# EAGLE design battery_monitor (EAGLE 9.4.1)
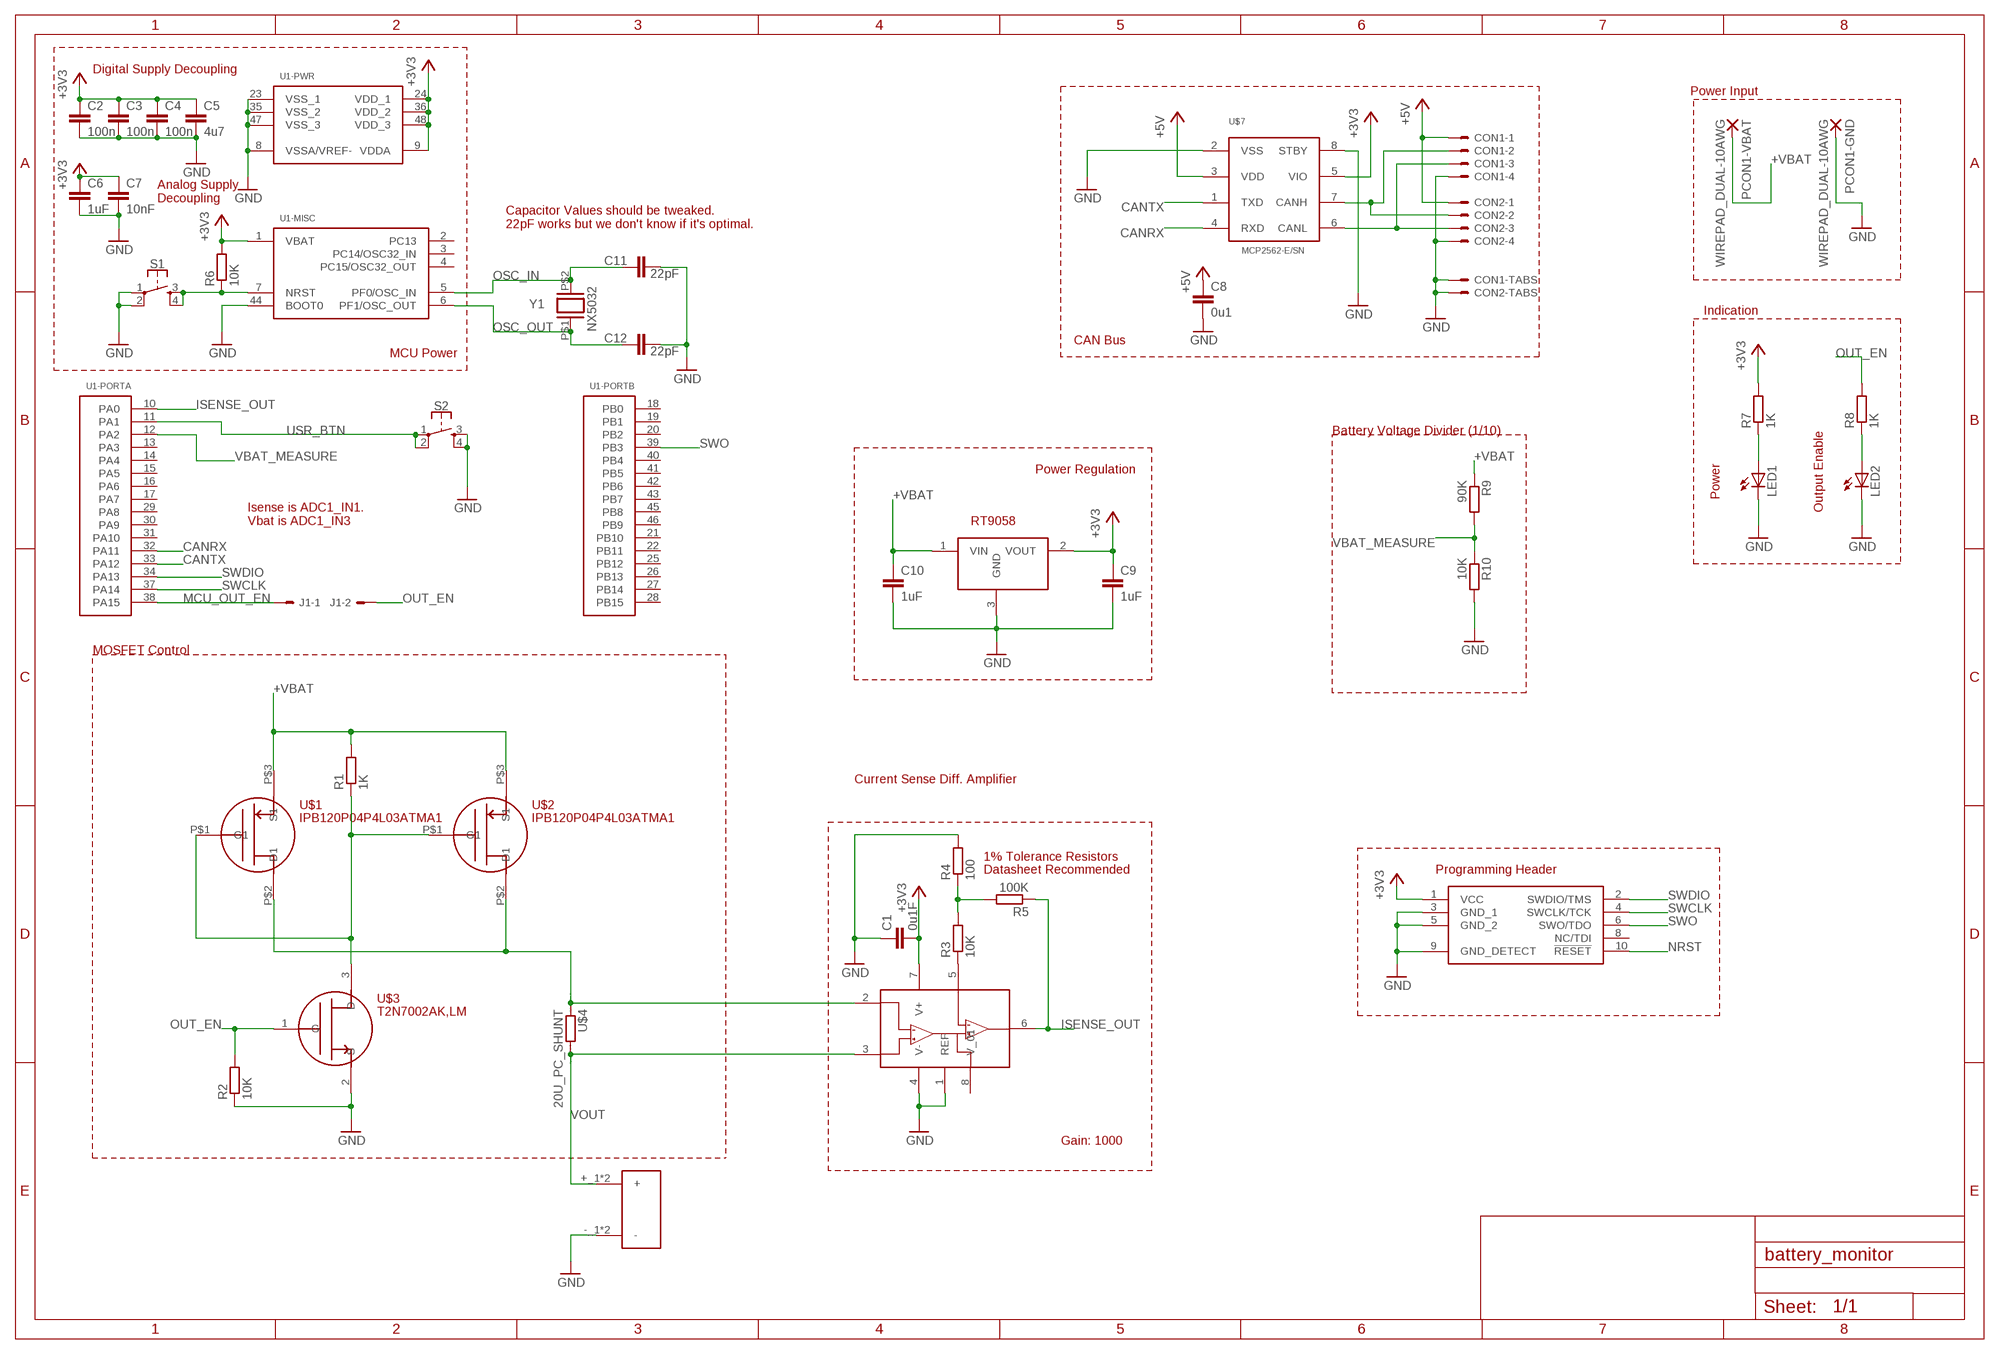
[diagram p0: schematic, sheet 1]

## Parts
C1  0u1F  C-EUC0805  [C0805]
C2  100n  C-EUC0805  [C0805]
C3  100n  C-EUC0805  [C0805]
C4  100n  C-EUC0805  [C0805]
C5  4u7  C-EUC0805  [C0805]
C6  1uF  C-EUC0805  [C0805]
C7  10nF  C-EUC0805  [C0805]
C8  0u1  C-EUC0805  [C0805]
C9  1uF  C-EUC0805  [C0805]
C10  1uF  C-EUC0805  [C0805]
C11  22pF  C-EUC0805  [C0805]
C12  22pF  C-EUC0805  [C0805]
CON1  SM04B-GHS-TB  [SM04B-GHS-TB]
CON2  SM04B-GHS-TB  [SM04B-GHS-TB]
J1  2PIN_HDR  [2PIN-HDR]
JP1  CORTEX-M-DBG  [FTSH-105-01-F-DV-007]
LED1  LEDCHIPLED_0805  [CHIPLED_0805]
LED2  LEDCHIPLED_0805  [CHIPLED_0805]
PCON1  WIREPAD_DUAL-10AWG  [WIREPAD_DUAL-10AWG]
R1  1K  R-EU_R0805  [R0805]
R2  10K  R-EU_R0805  [R0805]
R3  10K  R-EU_R0805  [R0805]
R4  100  R-EU_R0805  [R0805]
R5  100K  R-EU_R0805  [R0805]
R6  10K  R-EU_R0805  [R0805]
R7  1K  R-EU_R0805  [R0805]
R8  1K  R-EU_R0805  [R0805]
R9  90K  R-EU_R0805  [R0805]
R10  10K  R-EU_R0805  [R0805]
S1  MOMENTARY-SWITCH-SPST-2-SMD-4.6X2.8MM  [TACTILE_SWITCH_SMD_4.6X2.8MM]
S2  MOMENTARY-SWITCH-SPST-2-SMD-4.6X2.8MM  [TACTILE_SWITCH_SMD_4.6X2.8MM]
U1  STM32F303CB  [LQFP48]
U$1  IPB120P04P4L03ATMA1  [INFINEON_PG-TO263-3-2]
U$2  IPB120P04P4L03ATMA1  [INFINEON_PG-TO263-3-2]
U$3  T2N7002AK,LM  [SOT23]
U$4  20U_PC_SHUNT  [RSENSE_20U]
U$5  PP45_HOR_4GRD  [PP45_HOR_4GRD]
U$6  INA145  [SOIC8]
U$7  MCP2562-E/SN  [SOIC8]
U$8  RICHTEK_RT9058  [SOT23]
Y1  NX5032  [NX5032]

## Nets
+3V3: C1.2 C2.1 C3.1 C4.1 C5.1 C6.1 C7.1 C9.1 JP1.1(VCC) R6.2 R7.2 U1.1(-MISC:VBAT) U1.9(-PWR:VDDA) U1.24(-PWR:VDD_1) U1.36(-PWR:VDD_2) U1.48(-PWR:VDD_3) U$6.7(V+) U$7.5(VIO) U$8.2(VOUT)
+5V: C8.1 CON1.P$1 CON2.P$1 U$7.3(VDD)
+VBAT: C10.1 PCON1.+ R1.2 R9.1 U$1.P$3(S1) U$2.P$3(S1) U$8.1(VIN)
CANH: CON1.P$2 CON2.P$2 U$7.7(CANH)
CANL: CON1.P$3 CON2.P$3 U$7.6(CANL)
CANRX: U1.32(-PORTA:PA11) U$7.4(RXD)
CANTX: U1.33(-PORTA:PA12) U$7.1(TXD)
GND: C1.1 C2.2 C3.2 C4.2 C5.2 C6.2 C7.2 C8.2 C9.2 C10.2 C11.2 C12.2 CON1.P$4 CON1.P$5 CON1.P$6 CON2.P$4 CON2.P$5 CON2.P$6 JP1.3(GND_1) JP1.5(GND_2) JP1.9(GND_DETECT) LED1.C LED2.C PCON1.- R2.1 R4.2 R10.2 S1.1 S1.2 S2.3 S2.4 U1.8(-PWR:VSSA/VREF-) U1.23(-PWR:VSS_1) U1.35(-PWR:VSS_2) U1.44(-MISC:BOOT0) U1.47(-PWR:VSS_3) U$3.2(S) U$5.-_1(-) U$5.-_2(-) U$6.1(REF) U$6.4(V-) U$7.2(VSS) U$7.8(STBY) U$8.3(GND)
ISENSE_A: U$1.P$2(D1) U$2.P$2(D1) U$4.P$1 U$4.P$3 U$6.2(IN-)
ISENSE_OUT: R5.1 U1.10(-PORTA:PA0) U$6.6(OUT)
MCU_OUT_EN: J1.P$1 U1.38(-PORTA:PA15)
N$1: R1.1 U$1.P$1(G1) U$2.P$1(G1) U$3.3(D)
N$3: R3.1 U$6.5(VG)
N$4: R3.2 R4.1 R5.2
N$7: LED1.A R7.1
N$9: LED2.A R8.1
NRST: JP1.10(!RESET) R6.1 S1.3 S1.4 U1.7(-MISC:NRST)
OSC_IN: C11.1 U1.5(-MISC:PF0/OSC_IN) Y1.P$2
OSC_OUT: C12.1 U1.6(-MISC:PF1/OSC_OUT) Y1.P$1
OUT_EN: J1.P$2 R2.2 R8.2 U$3.1(G)
SWCLK: JP1.4(SWCLK/TCK) U1.37(-PORTA:PA14)
SWDIO: JP1.2(SWDIO/TMS) U1.34(-PORTA:PA13)
SWO: JP1.6(SWO/TDO) U1.39(-PORTB:PB3)
USR_BTN: S2.1 S2.2 U1.11(-PORTA:PA1)
VBAT_MEASURE: R9.2 R10.1 U1.12(-PORTA:PA2)
VOUT: U$4.P$2 U$4.P$4 U$5.+_1(+) U$5.+_2(+) U$6.3(IN+)
Unconnected: JP1.8(NC/TDI) U1.2(-MISC:PC13) U1.3(-MISC:PC14/OSC32_IN) U1.4(-MISC:PC15/OSC32_OUT) U1.13(-PORTA:PA3) U1.14(-PORTA:PA4) U1.15(-PORTA:PA5) U1.16(-PORTA:PA6) U1.17(-PORTA:PA7) U1.18(-PORTB:PB0) U1.19(-PORTB:PB1) U1.20(-PORTB:PB2) U1.21(-PORTB:PB10) U1.22(-PORTB:PB11) U1.25(-PORTB:PB12) U1.26(-PORTB:PB13) U1.27(-PORTB:PB14) U1.28(-PORTB:PB15) U1.29(-PORTA:PA8) U1.30(-PORTA:PA9) U1.31(-PORTA:PA10) U1.40(-PORTB:PB4) U1.41(-PORTB:PB5) U1.42(-PORTB:PB6) U1.43(-PORTB:PB7) U1.45(-PORTB:PB8) U1.46(-PORTB:PB9) U$6.8(V_01)

## Notes on the sheet
- Digital Supply Decoupling
- Power Input
- Analog Supply
  Decoupling
- Capacitor Values should be tweaked.
  22pF works but we don't know if it's optimal.
- Indication
- CAN Bus
- MCU Power
- Battery Voltage Divider (1/10)
- Power Regulation
- Power
- Output Enable
- Isense is ADC1_IN1.
  Vbat is ADC1_IN3
- RT9058
- MOSFET Control
- Current Sense Diff. Amplifier
- 1% Tolerance Resistors
- Datasheet Recommended | Programming Header
- Gain: 1000

## Library data of the parts
C1-C8 C11 C12 = resistor:C-EU: CAPACITOR, European symbol
C9 C10 = rcl:C-EU: CAPACITOR, European symbol; SPICEPREFIX: C
CON1 CON2 = SPEAR-general:SM04B-GHS-TB
J1 = SPEAR-battery-monitor:2PIN_HDR
JP1 = SPEAR-general:CORTEX-M-DBG: Cortex-M Debug Header Standard debug/programming header used for programming Cortex parts. Does not include shroud but does have key pin removed.
LED1 LED2 = led:LED: LED OSRAM: - CHIPLED LG R971, LG N971, LY N971, LG Q971, LY Q971, LO R971, LY R971 LH N974, LH R974 LS Q976, LO Q976, LY Q976 LO Q996 - Hyper CHIPLED LW Q18S LB Q993, LB Q99A, LB R99A - SideLED LS A670, LO A670, LY A670, LG A670, LP A670 LB A673, LV A673, LT A673, LW A673 LH A674 LY A675 LS A676, LA A676, LO A676, LY A676, LW A676 LS A679, LY A679, LG A679 - Hyper Micro SIDELED® LS Y876, LA Y876, LO Y876, LY Y876 LT Y87S - SmartLED LW L88C, LW L88S LB L89C, LB L89S, LG L890 LS L89K, LO L89K, LY L89K LS L896, LA L896, LO L896, LY L896 - TOPLED LS T670, LO T670, LY T670, LG T670, LP T670 LSG T670, LSP T670, LSY T670, LOP T670, LYG T670 LG T671, LOG T671, LSG T671 LB T673, LV T673, LT T673, LW T673 LH T674 LS T676, LA T676, LO T676, LY T676, LB T676, LH T676, LSB T676, LW T676 LB T67C, LV T67C, LT T67C, LS T67K, LO T67K, LY T67K, LW E67C LS E67B, LA E67B, LO E67B, LY E67B, LB E67C, LV E67C, LT E67C LW T67C LS T679, LY T679, LG T679 LS T770, LO T770, LY T770, LG T770, LP T770 LB T773, LV T773, LT T773, LW T773 LH T774 LS E675, LA E675, LY E675, LS T675 LS T776, LA T776, LO T776, LY T776, LB T776 LHGB T686 LT T68C, LB T68C - Hyper Mini TOPLED® LB M676 - Mini TOPLED Santana® LG M470 LS M47K, LO M47K, LY M47K Source: http://www.osram.convergy.de LUXEON: - LUMILED® LXK2-PW12-R00, LXK2-PW12-S00, LXK2-PW14-U00, LXK2-PW14-V00 LXK2-PM12-R00, LXK2-PM12-S00, LXK2-PM14-U00 LXK2-PE12-Q00, LXK2-PE12-R00, LXK2-PE12-S00, LXK2-PE14-T00, LXK2-PE14-U00 LXK2-PB12-K00, LXK2-PB12-L00, LXK2-PB12-M00, LXK2-PB14-N00, LXK2-PB14-P00, LXK2-PB14-Q00 LXK2-PR12-L00, LXK2-PR12-M00, LXK2-PR14-Q00, LXK2-PR14-R00 LXK2-PD12-Q00, LXK2-PD12-R00, LXK2-PD12-S00 LXK2-PH12-R00, LXK2-PH12-S00 LXK2-PL12-P00, LXK2-PL12-Q00, LXK2-PL12-R00 Source: www.luxeon.com KINGBRIGHT: KA-3528ASYC Source: www.kingbright.com
PCON1 = SPEAR-battery-monitor:WIREPAD_DUAL-10AWG
R1-R10 = resistor:R-EU_: RESISTOR, European symbol
S1 S2 = SPEAR-arm-control:MOMENTARY-SWITCH-SPST-2: Momentary Switch (Pushbutton) - SPST - Two Circuits Normally-open (NO) SPST momentary switches (buttons, pushbuttons). Schematic symbol includes two switch circuits. Variants SMD-4.6MMX2.8MM - 4.60mm x 2.80mm Tactile Momentary Button Switch - Used on SparkFun SAMD21 Mini Breakout <https://www.sparkfun.com/products/13664> SMD-5.2MM - Mini Pushbutton Switch - SMD <https://www.sparkfun.com/products/8720> - Used on Arduino Pro Mini <https://www.sparkfun.com/products/11114>; PROD_ID: SWCH-13065
U1 = SPEAR-general:STM32F303CB: STM32F303CBT 32-bit microcontroller in an LQFP48 package - 128Kbytes flash.
U$1 U$2 = SPEAR-battery-monitor:IPB120P04P4L03ATMA1: Infineon IPB120P04P4L03ATMA1 High power, low Rds(on) P-channel MOSFET. Datasheet here. <https://www.infineon.com/dgdl/Infineon-IPP_B_I120P04P4L_03-DS-v01_01-EN.pdf?fileId=db3a30432f69f146012f783b3b5a2e3f&ack=t>
U$3 = SPEAR-battery-monitor:T2N7002AK,LM: T2N7002AK Small N-channel MOSFET from Toshiba. Datasheet here. <file:///C:/Users/David/Downloads/T2N7002AK_datasheet_en_20150401.pdf>
U$4 = SPEAR-battery-monitor:20U_PC_SHUNT: PCB Current Shunt Approximately 20uOhm. If you want actual measurements, verify first.
U$5 = SPEAR-general:PP45_HOR_4GRD
U$6 = SPEAR-battery-monitor:INA145: INA145 Texas Instruments differential amplifier. Programmable gain from 1-1000. Datasheet. <http://www.ti.com/lit/ds/symlink/ina145.pdf>
U$7 = SPEAR-general:MCP2562-E/SN
U$8 = SPEAR-battery-monitor:RICHTEK_RT9058: RT9058 3v3 LDO regulator. Datasheet. <https://www.richtek.com/assets/product_file/RT9058/DS9058-01.pdf>
Y1 = SPEAR-general:NX5032

## Board
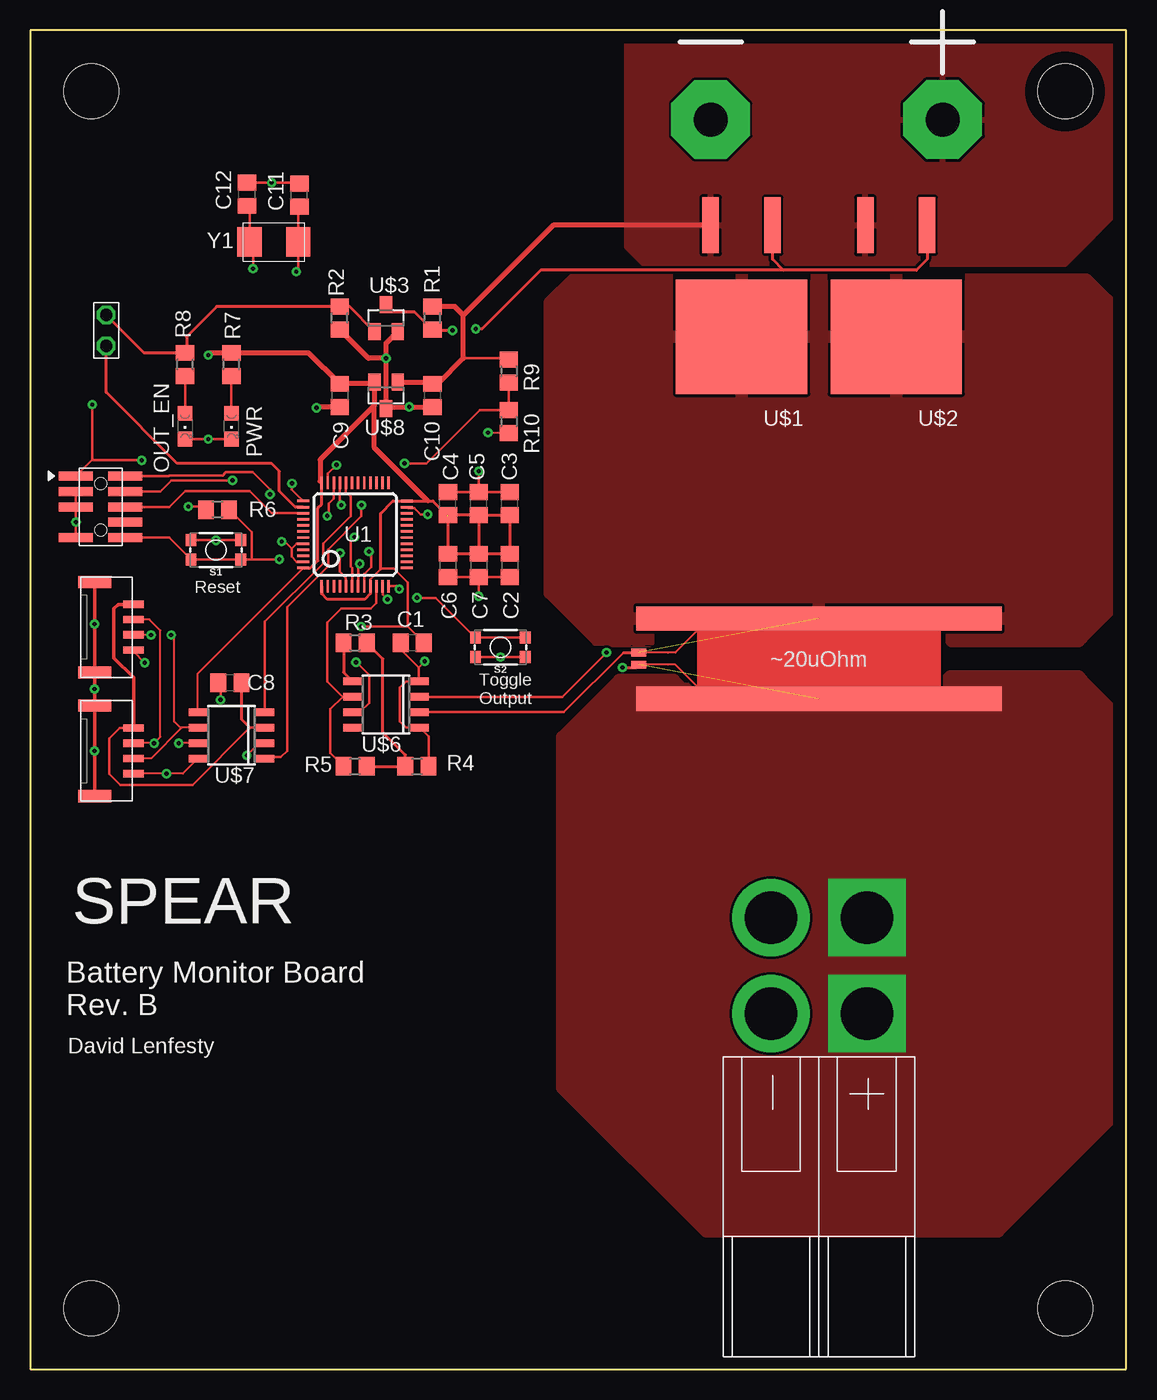
[diagram p1: board, top side]
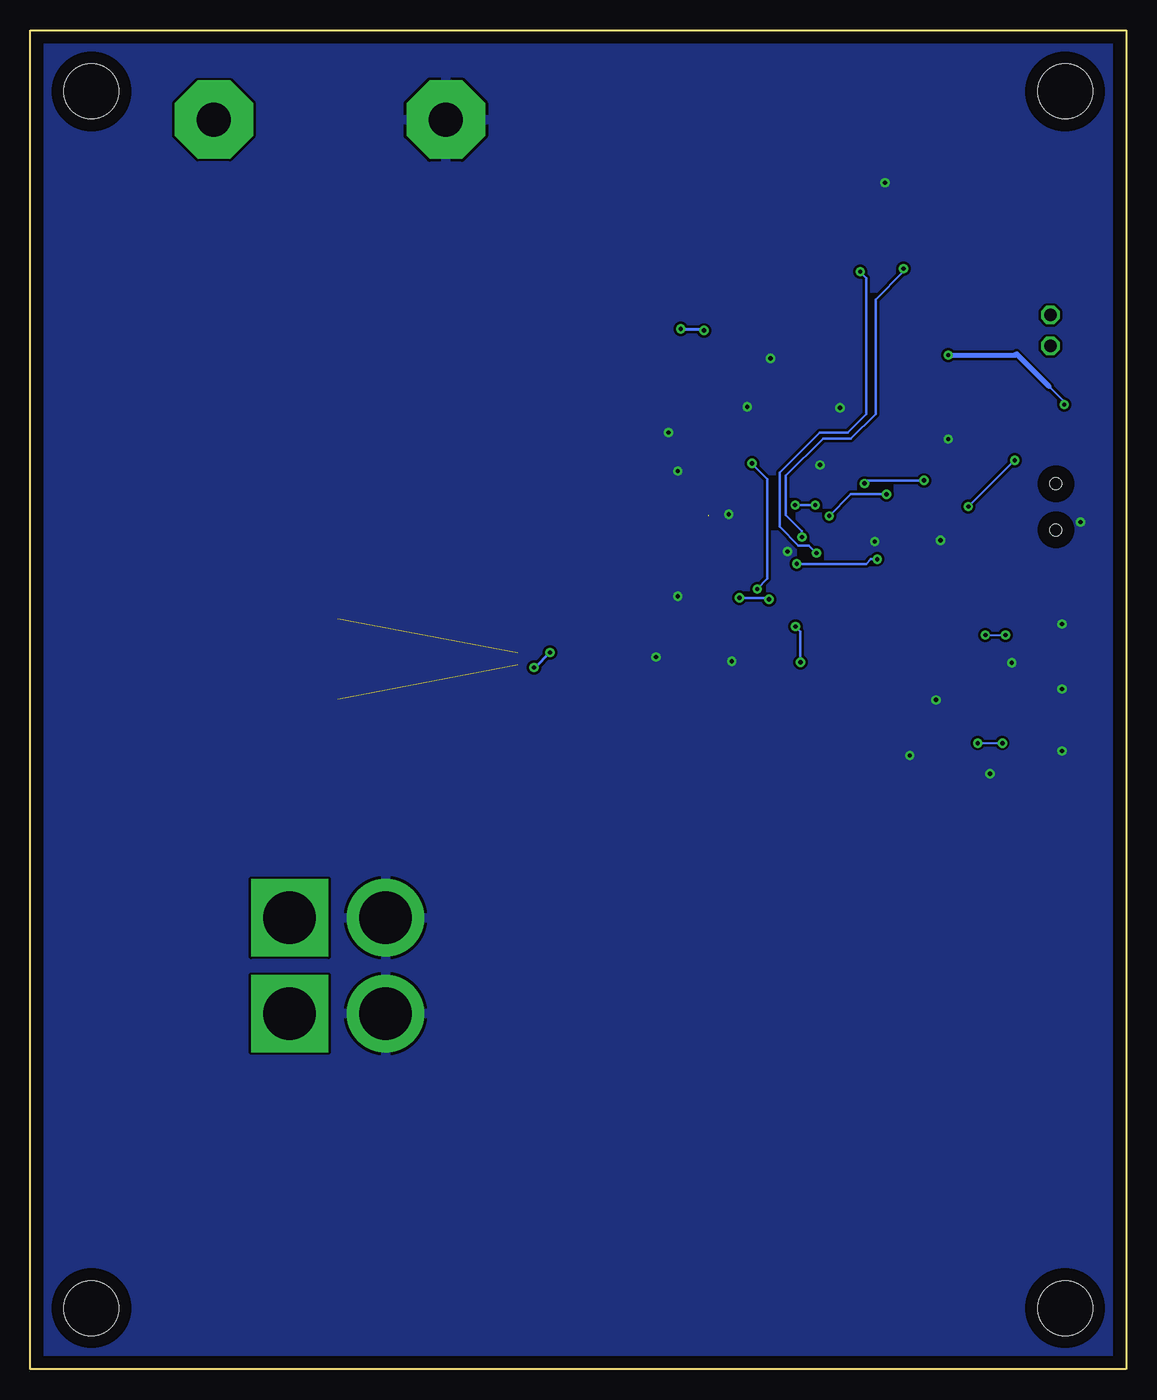
[diagram p2: board, bottom side, seen from below]

Size 90 x 110 mm. Coordinates in mm from the lower left corner, seen from the top.
Outline: 0,0 90,0 90,110 0,110 0,0
Copper layers (1*16): Top 0.035mm / dielectric 1.5mm / Bottom 0.035mm
Design rules "default *": minimum track width 6mil, minimum drill 0.35mm, track to track 8mil, track to pad 8mil, pad to pad 8mil, via to via 8mil, smd to smd 8mil, copper to edge 40mil, drill to drill 6mil, minimum pad ring 10mil, minimum via ring 8mil, stop-mask expansion 4mil, vias tented up to drill 0mil, thermal gap 10mil
Holes 4.5 mm at 5,5 85,5 85,105 5,105

### Footprints (pad centres in the part's own frame; a part is rotated, then mirrored left to right if it is on the bottom)
C0805 = smd 1.3 x 1.5: 1 -0.95,0; 2 0.95,0
SM04B-GHS-TB = smd 0.6 x 1.7: P$1 -1.875,0.85; P$2 -0.625,0.85; P$3 0.625,0.85; P$4 1.875,0.85 | smd 1 x 2.7: P$5 -3.725,-2.35; P$6 3.725,-2.35
2PIN-HDR = drill 1.016 octagon: P$1 -1.27,0; P$2 1.27,0
FTSH-105-01-F-DV-007 = smd 0.737 x 2.794: 1 -2.54,-2.032; 2 -2.54,2.032; 3 -1.27,-2.032; 4 -1.27,2.032; 5 0,-2.032; 6 0,2.032; 8 1.27,2.032; 9 2.54,-2.032; 10 2.54,2.032 | hole 0.965: -1.905,0; 1.905,0
CHIPLED_0805 = smd 1.2 x 1.2: A 0,-1.05; C 0,1.05
WIREPAD_DUAL-10AWG = drill 2.794 pad 6.452 octagon: + -8.89,0; - 10.16,0
R0805 = smd 1.3 x 1.5: 1 -0.95,0; 2 0.95,0
TACTILE_SWITCH_SMD_4.6X2.8MM = smd 0.9 x 1: 1 -2.05,-0.8; 2 2.05,-0.8; 3 2.05,0.8; 4 -2.05,0.8
LQFP48 = smd 0.2 x 1: 1 -2.75,-4.25; 2 -2.25,-4.25; 3 -1.75,-4.25; 4 -1.25,-4.25; 5 -0.75,-4.25; 6 -0.25,-4.25; 7 0.25,-4.25; 8 0.75,-4.25; 9 1.25,-4.25; 10 1.75,-4.25; 11 2.25,-4.25; 12 2.75,-4.25; 25 2.75,4.25; 26 2.25,4.25; 27 1.75,4.25; 28 1.25,4.25; 29 0.75,4.25; 30 0.25,4.25; 31 -0.25,4.25; 32 -0.75,4.25; 33 -1.25,4.25; 34 -1.75,4.25; 35 -2.25,4.25; 36 -2.75,4.25 | smd 1 x 0.2: 13 4.25,-2.75; 14 4.25,-2.25; 15 4.25,-1.75; 16 4.25,-1.25; 17 4.25,-0.75; 18 4.25,-0.25; 19 4.25,0.25; 20 4.25,0.75; 21 4.25,1.25; 22 4.25,1.75; 23 4.25,2.25; 24 4.25,2.75; 37 -4.25,2.75; 38 -4.25,2.25; 39 -4.25,1.75; 40 -4.25,1.25; 41 -4.25,0.75; 42 -4.25,0.25; 43 -4.25,-0.25; 44 -4.25,-0.75; 45 -4.25,-1.25; 46 -4.25,-1.75; 47 -4.25,-2.25; 48 -4.25,-2.75
INFINEON_PG-TO263-3-2 = smd 1.35 x 4.6: P$1 -2.54,0; P$3 2.54,0 | smd 10.8 x 9.4: P$2 0,9.15
SOT23 = smd 1 x 1.4: 1 -0.95,-1.1; 2 0.95,-1.1; 3 0,1.1
RSENSE_20U = smd 30 x 2: P$1 0,3.26; P$2 0,-3.34 | smd 1.27 x 0.635: P$3 -14.8,0.46; P$4 -14.8,-0.54
PP45_HOR_4GRD = drill 4.318 pad 6.35 square: +_1 0,3.937; +_2 -7.874,3.937 | drill 4.318 pad 6.35: -_1 0,-3.937; -_2 -7.874,-3.937
SOIC8 = smd 0.6 x 1.5: 1 -1.905,-2.75; 2 -0.635,-2.75; 3 0.635,-2.75; 4 1.905,-2.75; 5 1.905,2.75; 6 0.635,2.75; 7 -0.635,2.75; 8 -1.905,2.75
NX5032 = smd 2 x 2.4: P$1 -2,0; P$2 2,0

### Placement (x,y rotation side)
C1  31.37,59.69 0 top
C2  39.37,66.04 270 top
C3  39.37,71.12 90 top
C4  34.29,71.12 90 top
C5  36.83,71.12 90 top
C6  34.29,66.04 270 top
C7  36.83,66.04 270 top
C8  16.38,56.39 180 top
C9  25.4,80.01 270 top
C10  33.02,80.01 270 top
C11  22.09,96.45 90 top
C12  17.79,96.53 90 top
CON1  7.62,50.8 270 top
CON2  7.62,60.96 270 top
J1  6.22,85.34 90 top
JP1  5.77,70.85 270 top
LED1  16.51,77.47 180 top
LED2  12.7,77.47 180 top
PCON1  66.04,102.68 180 top
R1  33.02,86.36 90 top
R2  25.4,86.36 90 top
R3  26.67,59.69 0 top
R4  31.75,49.53 0 top
R5  26.67,49.53 0 top
R6  15.37,70.61 180 top
R7  16.51,82.55 90 top
R8  12.7,82.55 90 top
R9  39.29,82 270 top
R10  39.29,77.86 270 top
S1  15.24,67.31 180 top
S2  38.61,59.31 180 top
U1  26.67,68.58 0 top
U$1  58.42,93.98 180 top
U$2  71.12,93.98 180 top
U$3  29.21,86.36 0 top
U$4  64.77,58.42 0 top
U$5  64.77,29.21 270 top
U$6  29.21,54.61 90 top
U$7  16.51,52.07 90 top
U$8  29.21,80.01 180 top
Y1  20,92.62 0 top

### Tracks (layer width: path | path; a pad name or v marks a point on that pad's centre or on a via)
+3V3  (via drill 0.35)  (1 unrouted)
  Top 0.152: U$7.5 13.76,57.17 U1.48
  Top 0.203: U$6.7 27.05,53.98 27.81,54.74 27.81,57.02 v26.75,58.09 | 23.79,72.96 U1.36 | v27.15,61.02 30.99,61.02 | 30.99,61.02 | 30.99,61.02 C1.2 | 30.99,61.02 30.99,64.64 29.84,65.79 28.81,65.79 28.76,65.73 27.92,64.9 U1.9 | JP1.1 5.08,74.73 | 5.08,74.73 v5.08,79.25 | R6.2 14.16,70.87 v12.95,70.87 | v9.14,74.68 5.13,74.68 5.08,74.73
  Top 0.254: 34.29,70.1 33.06,71.33 32.64,71.33 U1.24 29.78,71.33 28.76,70.31 28.76,65.73 | U1.48 23,65.83 23.61,66.44 23.61,70.74 23.92,71.05 U1.36 | U1.1 23.92,63.71 24.38,63.25 27.46,63.25 27.92,63.71 U1.9 | C5.1 C4.1 C6.1 C7.1 | C5.1 C3.1 C2.1 C7.1 | C5.1 C7.1
  Top 0.406: v14.61,83.31 14.79,83.5 R7.2 22.86,83.5 C9.1 28.11,80.96 U$8.2 28.26,79.19 | 23.79,72.96 23.79,74.72 28.26,79.19 | 32.64,71.33 28.26,75.71 28.26,79.19
  Bottom 0.203: v26.75,58.09 26.75,60.62 v27.15,61.02 | v5.08,79.25 5.08,79.5 6.35,80.77 | v12.95,70.87 v9.14,74.68
  Bottom 0.406: v14.61,83.31 9.14,83.31 9.02,83.44 6.35,80.77
+5V
  Top 0.203: U$7.3 18.03,52.7 13.34,48.01 7.37,48.01 6.48,48.9 6.48,51.82 7.34,52.67 CON1.P$1
  Top 0.254: C8.1 17.33,53.41 18.03,52.7
  Top 0.305: CON2.P$1 7.21,62.84 6.86,62.48 6.86,58.42 8.47,56.81 CON1.P$1
+VBAT
  Top 0.203: 35.56,83.06 39.19,83.06 R9.1
  Top 0.254: U$8.1 32.87,81.11 C10.1
  Top 0.406: U$8.1 33.44,81.11 33.53,81.03 35.56,83.06 35.56,86.61 | 35.56,86.61 34.86,87.31 R1.2 | U$1.P$3 42.93,93.98 35.56,86.61
  pour Top: 64.26,118.49 88.01,118.49 88.14,118.36 89.66,116.84 89.66,116.59 89.66,95.5 84.96,90.81 50.42,90.81 49.02,92.2 49.02,115.95 51.56,118.49
CANH  (via drill 0.35)
  Top 0.152: U$7.7 v12.19,51.44 | CON1.P$2 8.48,51.44 v10.16,51.44 10.67,51.94 10.67,60.71 9.78,61.59 9.77,61.59 CON2.P$2
  Bottom 0.152: v12.19,51.44 v10.16,51.44
CANL  (via drill 0.35)
  Top 0.152: U$7.6 12.45,52.7 | CON1.P$3 9.92,50.17 12.45,52.7 | v11.56,60.33 11.81,60.07 11.81,53.21 12.32,52.7 12.45,52.7 | v9.91,60.33 9.9,60.34 CON2.P$3
  Bottom 0.152: v11.56,60.33 v9.91,60.33
CANRX
  Top 0.203: U$7.4 19.26,61.42 24.04,66.2 24.04,67.84 26.3,70.1 26.3,71.69 25.92,72.07 U1.32
CANTX  (via drill 0.35)
  Top 0.203: U$7.1 19.39,50.29 20.57,50.29 21.08,50.8 21.08,62.62 24.45,65.98 24.45,67.36 27.19,70.1 v27.19,70.99 | U1.33 25.42,71.1 v25.53,70.99
  Bottom 0.203: v27.19,70.99 v25.53,70.99
GND  (via drill 0.35)
  Top 0.152: U$7.2 18.8,51.44 v17.78,50.42 | U$7.8 12.52,48.92 v11.18,48.92 CON1.P$4
  Top 0.203: CON2.P$4 8.47,58.97 v9.4,58.04 | C8.2 15.62,56.2 v15.62,54.99 | R4.2 32.7,51.97 U$6.1 30.86,52.7 30.35,53.21 30.35,56.01 30.86,56.52 U$6.4 31.88,56.6 31.88,57.66 | 31.88,57.66 30.42,59.12 C1.1 | 31.88,57.66 v32.38,58.17 | C2.2 C7.2 | C7.2 C6.2 | C7.2 v36.83,63.5 | C4.2 C5.2 | C5.2 C3.2 | C5.2 v36.83,73.79 | U1.23 31.02,70.73 31.55,70.73 32.05,70.23 v32.64,70.23 | U1.8 27.42,65.32 27.99,65.88 27.99,67.01 v27.81,67.18 | U1.47 21.89,66.33 21.46,66.76 21.46,67.44 | U1.35 24.42,73.57 v25.15,74.3 | S1.1 v15.24,68.11 S1.2 | 21.46,67.44 20.9,68 v20.65,68 | LED2.C v14.61,76.42 LED1.C | 21.46,67.44 21.86,67.83 U1.44 | S2.4 v38.61,58.51 S2.3 | C12.2 v19.81,97.48 22.01,97.48 C11.2 | R10.2 v37.59,76.96 | JP1.3 JP1.5 v3.74,69.6 JP1.9
  Top 0.305: CON1.P$6 v5.27,50.8 CON1.P$5 v5.27,55.88 CON2.P$6 v5.27,61.21 CON2.P$5
  Top 0.406: C10.2 v31.11,79.06 29.36,79.06 U$8.3 v29.21,83.06 | C9.2 23.56,79.06 v23.5,78.99 | v29.21,83.06 29.21,84.31 U$3.2 | v29.21,83.06 27.75,83.06 R2.1
  pour Bottom: 0.08,109.83 89.52,109.83 89.52,0.56 0.08,0.56
ISENSE_A  (1 unrouted)
  Top 0.203: U$6.2 43.81,53.98 48.72,58.88
  Top 0.254: 48.72,58.88 U$4.P$3
  pour Top: 51.56,60.71 50.8,59.94 50.8,59.82 46.61,59.82 42.67,63.75 42.67,78.36 42.67,87.63 44.58,89.53 86.74,89.53 89.92,86.36 89.92,63.63 86.36,60.07 86.11,59.82 75.95,59.82 75.69,59.82 74.55,60.96 51.82,60.96
ISENSE_OUT
  Top 0.203: R5.1 24.64,50.61 24.64,54.23 25.65,55.24 | 25.65,55.24 U$6.6 | 25.65,55.24 24.38,56.52 24.38,61.34 25.53,62.48 27.94,62.48 28.42,62.96 U1.10
MCU_OUT_EN
  Top 0.254: J1.P$1 6.22,80.26 12.06,74.42 19.81,74.42 20.45,73.79 20.45,72.14 21.77,70.82 U1.38
N$1  (via drill 0.35)
  Top 0.254: U$2.P$1 73.66,91.19 72.77,90.3 61.85,90.3 | 61.85,90.3 60.96,91.19 U$1.P$1 | 61.85,90.3 41.91,90.3 37.08,85.47 v36.58,85.47 | v34.67,85.34 33.09,85.34 R1.1 31.56,86.87 29.8,86.87 U$3.3
  Bottom 0.254: v36.58,85.47 34.8,85.47 v34.67,85.34
N$3
  Top 0.254: R3.1 25.72,57.26 U$6.5
N$4
  Top 0.254: R5.2 R4.1 30.8,50.48 28.96,52.32 28.96,58.35 R3.2
N$7
  Top 0.203: R7.1 LED1.A
N$9
  Top 0.203: R8.1 LED2.A
NRST  (via drill 0.35)
  Top 0.203: 18.16,66.51 S1.4 S1.3 11.39,68.31 JP1.10 | 18.16,66.51 20.41,66.51 v20.45,66.55 | v27.05,66.17 26.92,66.04 U1.7 | R6.1 18.16,68.77 18.16,66.51
  Bottom 0.203: v27.05,66.17 21.34,66.17 20.95,66.55 v20.45,66.55
OSC_IN  (via drill 0.35)
  Top 0.203: U1.5 25.92,65.01 25.4,65.53 25.4,67.03 v25.43,67.06 | v21.84,90.17 22,90.33 Y1.P$2 22,95.41 C11.1
  Bottom 0.203: v25.43,67.06 26.06,67.69 26.91,67.69 28.45,69.22 28.45,73.66 25.15,76.96 22.86,76.96 21.34,78.49 21.34,89.66 v21.84,90.17
OSC_OUT  (via drill 0.35)
  Top 0.203: v26.63,68.37 26.32,68.07 26.32,65.93 26.42,65.83 U1.6 | v18.29,90.42 18.29,92.33 Y1.P$1 18,95.38 C12.1
  Bottom 0.203: v26.63,68.37 26.63,68.88 27.94,70.19 27.94,73.41 24.89,76.45 22.61,76.45 20.57,78.49 20.57,87.88 18.29,90.17 v18.29,90.42
OUT_EN
  Top 0.254: U$3.1 26.21,87.31 R2.2 15.3,87.31 12.83,84.84 12.83,83.63 12.73,83.53 | 12.73,83.53 R8.2 | J1.P$2 9.3,83.53 12.73,83.53
SWCLK  (via drill 0.35)
  Top 0.203: v21.48,72.77 21.48,72.27 U1.37 | JP1.4 10.65,72.12 11.55,73.02 v16.6,73.02
  Bottom 0.203: v21.48,72.77 21.23,73.02 v16.6,73.02
SWDIO  (via drill 0.35)
  Top 0.203: v24.38,70.1 24.51,70.23 24.51,71.13 24.92,71.53 U1.34 | JP1.2 11.35,73.39 11.39,73.43 15.79,73.43 16.06,73.7 18.24,73.7 19.68,72.26 v19.68,71.88
  Bottom 0.203: v24.38,70.1 22.61,71.88 v19.68,71.88
SWO
  Top 0.203: JP1.6 11.42,70.85 12.7,72.14 18.03,72.14 19.84,70.33 U1.39
USR_BTN  (via drill 0.35)
  Top 0.203: v31.75,63.37 33.29,63.37 S2.2 S2.1 | v29.34,63.25 28.92,63.67 U1.11
  Bottom 0.203: v31.75,63.37 29.46,63.37 v29.34,63.25
VBAT_MEASURE  (via drill 0.35)
  Top 0.203: R9.2 R10.1 36.9,78.81 32.51,74.42 v30.73,74.42 | v30.3,64.11 30.08,64.33 U1.12
  Bottom 0.203: v30.73,74.42 29.46,73.15 29.46,64.95 v30.3,64.11
VOUT  (via drill 0.35)  (1 unrouted)
  Top 0.203: U$6.3 43.69,55.24 v47.32,58.88
  Top 0.254: v48.64,57.66 49.75,57.66 U$4.P$4
  Bottom 0.254: v47.32,58.88 48.59,57.61 v48.64,57.66
  pour Top (no thermals): 54.86,55.88 53.59,55.88 52.83,56.64 48.39,56.64 43.69,51.94 43.69,23.11 55.5,11.3 79.5,11.3 90.55,22.35 90.55,52.45 86.36,56.64 86.11,56.9 75.56,56.9 75.06,56.39 75.06,55.63 55.12,55.63

### Text on the board
tPlace: PWR | OUT_EN | Reset | Toggle / Output | SPEAR | Battery Monitor Board / Rev. B | David Lenfesty